# Altium schematic sheet FC_Conn.SchDoc
size A3; SheetNumber: 6; SheetTotal: 10
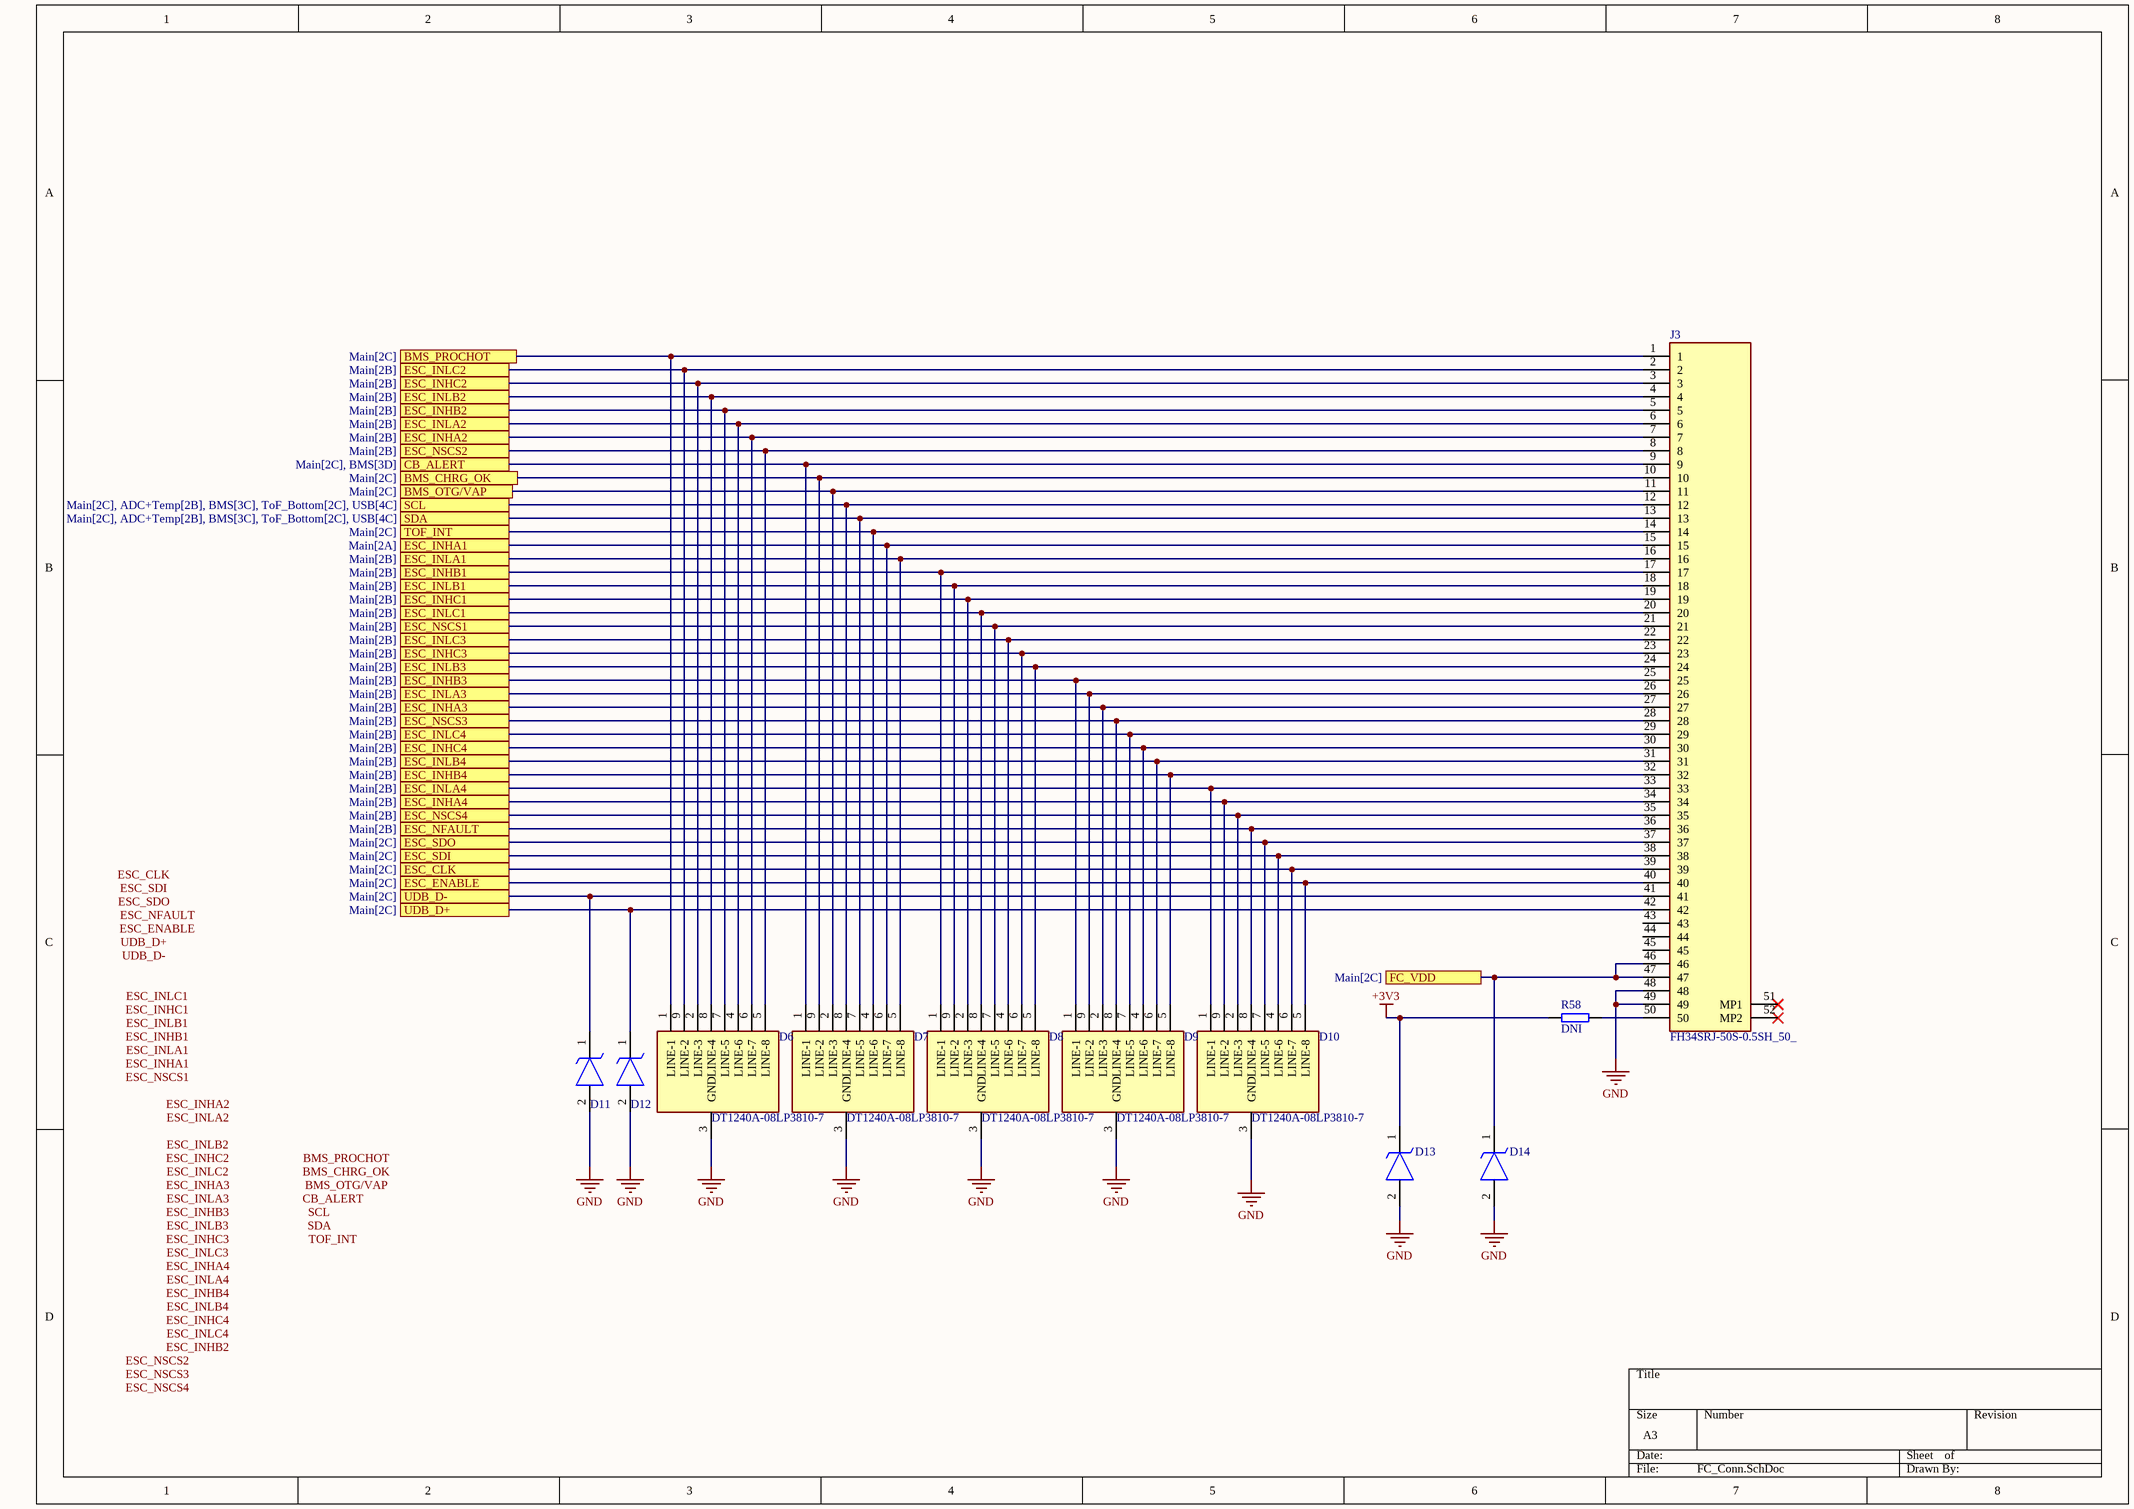
[diagram p0: FC_Conn.SchDoc]

## Parts
D6  DT1240A-08LP3810-7  [DT1240A08LP38107]
D7  DT1240A-08LP3810-7  [DT1240A08LP38107]
D8  DT1240A-08LP3810-7  [DT1240A08LP38107]
D9  DT1240A-08LP3810-7  [DT1240A08LP38107]
D10  DT1240A-08LP3810-7  [DT1240A08LP38107]
D11  D1213A-01LP4-7B  [D1213A01LP47B]  (value not drawn)
D12  D1213A-01LP4-7B  [D1213A01LP47B]  (value not drawn)
D13  DF2S24FS,L3M  [SODFL1006X45N]  (value not drawn)
D14  DF2S24FS,L3M  [SODFL1006X45N]  (value not drawn)
J3  FH34SRJ-50S-0.5SH_50_  [FH34SRJ50S05SH50]
R58  value DNI  [RES0402]  (hidden comment: Res0402)

## Ports
BMS_CHRG_OK (see Main[2C]), BMS_OTG/VAP (see Main[2C]), BMS_PROCHOT (see Main[2C]), CB_ALERT (see Main[2C], BMS[3D]), ESC_CLK (see Main[2C]), ESC_ENABLE (see Main[2C]), ESC_INHA1 (see Main[2A]), ESC_INHA2 (see Main[2B]), ESC_INHA3 (see Main[2B]), ESC_INHA4 (see Main[2B]), ESC_INHB1 (see Main[2B]), ESC_INHB2 (see Main[2B]), ESC_INHB3 (see Main[2B]), ESC_INHB4 (see Main[2B]), ESC_INHC1 (see Main[2B]), ESC_INHC2 (see Main[2B]), ESC_INHC3 (see Main[2B]), ESC_INHC4 (see Main[2B]), ESC_INLA1 (see Main[2B]), ESC_INLA2 (see Main[2B]), ESC_INLA3 (see Main[2B]), ESC_INLA4 (see Main[2B]), ESC_INLB1 (see Main[2B]), ESC_INLB2 (see Main[2B]), ESC_INLB3 (see Main[2B]), ESC_INLB4 (see Main[2B]), ESC_INLC1 (see Main[2B]), ESC_INLC2 (see Main[2B]), ESC_INLC3 (see Main[2B]), ESC_INLC4 (see Main[2B]), ESC_NFAULT (see Main[2B]), ESC_NSCS1 (see Main[2B]), ESC_NSCS2 (see Main[2B]), ESC_NSCS3 (see Main[2B]), ESC_NSCS4 (see Main[2B]), ESC_SDI (see Main[2C]), ESC_SDO (see Main[2C]), FC_VDD (see Main[2C]), SCL (see Main[2C], ADC+Temp[2B], BMS[3C], ToF_Bottom[2C], USB[4C]), SDA (see Main[2C], ADC+Temp[2B], BMS[3C], ToF_Bottom[2C], USB[4C]), TOF_INT (see Main[2C]), UDB_D+ (see Main[2C]), UDB_D- (see Main[2C])

## Nets
+3V3: D13.1(K) R58.2
GND: D6.3(GND) D7.3(GND) D8.3(GND) D9.3(GND) D10.3(GND) D11.2(A) D12.2(A) D13.2(A) D14.2(A) J3.48 J3.49
BMS_CHRG_OK: D7.9(LINE-2) J3.10 ; port BMS_CHRG_OK
BMS_OTG/VAP: D7.2(LINE-3) J3.11 ; port BMS_OTG/VAP
BMS_PROCHOT: D6.1(LINE-1) J3.1 ; port BMS_PROCHOT
CB_ALERT: D7.1(LINE-1) J3.9 ; port CB_ALERT
ESC_CLK: D10.6(LINE-7) J3.39 ; port ESC_CLK
ESC_ENABLE: D10.5(LINE-8) J3.40 ; port ESC_ENABLE
ESC_INHA1: D7.6(LINE-7) J3.15 ; port ESC_INHA1
ESC_INHA2: D6.6(LINE-7) J3.7 ; port ESC_INHA2
ESC_INHA3: D9.2(LINE-3) J3.27 ; port ESC_INHA3
ESC_INHA4: D10.9(LINE-2) J3.34 ; port ESC_INHA4
ESC_INHB1: D8.1(LINE-1) J3.17 ; port ESC_INHB1
ESC_INHB2: D6.7(LINE-5) J3.5 ; port ESC_INHB2
ESC_INHB3: D9.1(LINE-1) J3.25 ; port ESC_INHB3
ESC_INHB4: D9.5(LINE-8) J3.32 ; port ESC_INHB4
ESC_INHC1: D8.2(LINE-3) J3.19 ; port ESC_INHC1
ESC_INHC2: D6.2(LINE-3) J3.3 ; port ESC_INHC2
ESC_INHC3: D8.6(LINE-7) J3.23 ; port ESC_INHC3
ESC_INHC4: D9.4(LINE-6) J3.30 ; port ESC_INHC4
ESC_INLA1: D7.5(LINE-8) J3.16 ; port ESC_INLA1
ESC_INLA2: D6.4(LINE-6) J3.6 ; port ESC_INLA2
ESC_INLA3: D9.9(LINE-2) J3.26 ; port ESC_INLA3
ESC_INLA4: D10.1(LINE-1) J3.33 ; port ESC_INLA4
ESC_INLB1: D8.9(LINE-2) J3.18 ; port ESC_INLB1
ESC_INLB2: D6.8(LINE-4) J3.4 ; port ESC_INLB2
ESC_INLB3: D8.5(LINE-8) J3.24 ; port ESC_INLB3
ESC_INLB4: D9.6(LINE-7) J3.31 ; port ESC_INLB4
ESC_INLC1: D8.8(LINE-4) J3.20 ; port ESC_INLC1
ESC_INLC2: D6.9(LINE-2) J3.2 ; port ESC_INLC2
ESC_INLC3: D8.4(LINE-6) J3.22 ; port ESC_INLC3
ESC_INLC4: D9.7(LINE-5) J3.29 ; port ESC_INLC4
ESC_NFAULT: D10.8(LINE-4) J3.36 ; port ESC_NFAULT
ESC_NSCS1: D8.7(LINE-5) J3.21 ; port ESC_NSCS1
ESC_NSCS2: D6.5(LINE-8) J3.8 ; port ESC_NSCS2
ESC_NSCS3: D9.8(LINE-4) J3.28 ; port ESC_NSCS3
ESC_NSCS4: D10.2(LINE-3) J3.35 ; port ESC_NSCS4
ESC_SDI: D10.4(LINE-6) J3.38 ; port ESC_SDI
ESC_SDO: D10.7(LINE-5) J3.37 ; port ESC_SDO
FC_VDD: D14.1(K) J3.46 J3.47 ; port FC_VDD
SCL: D7.8(LINE-4) J3.12 ; port SCL
SDA: D7.7(LINE-5) J3.13 ; port SDA
TOF_INT: D7.4(LINE-6) J3.14 ; port TOF_INT
UDB_D+: D12.1(K) J3.42 ; port UDB_D+
UDB_D-: D11.1(K) J3.41 ; port UDB_D-
NetJ3_50: J3.50 R58.1

Not connected (* = marked no-connect by the designer): J3 43 44 45 51(MP1)* 52(MP2)*

## Notes on the sheet
- Each ESC can output 30mA, PB schould be able to sustain itself
- Labels drawn without touching a wire or pin: BMS_CHRG_OK, BMS_OTG/VAP, BMS_PROCHOT, CB_ALERT, ESC_CLK, ESC_ENABLE, ESC_INHA1, ESC_INHA2, ESC_INHA3, ESC_INHA4, ESC_INHB1, ESC_INHB2, ESC_INHB3, ESC_INHB4, ESC_INHC1, ESC_INHC2, ESC_INHC3, ESC_INHC4, ESC_INLA1, ESC_INLA2, ESC_INLA3, ESC_INLA4, ESC_INLB1, ESC_INLB2, ESC_INLB3, ESC_INLB4, ESC_INLC1, ESC_INLC2, ESC_INLC3, ESC_INLC4, ESC_NFAULT, ESC_NSCS1, ESC_NSCS2, ESC_NSCS3, ESC_NSCS4, ESC_SDI, ESC_SDO, SCL, SDA, TOF_INT, UDB_D+, UDB_D-

## Library data of the parts
D6-D10 = DT1240A-08LP3810-7: TVS Diode (Uni-directional); Manufacturer_Name: Diodes Incorporated; Datasheet Link: https://www.diodes.com//assets/Datasheets/DT1240A-08LP3810.pdf; Height: 0.55mm; Manufacturer_Part_Number: DT1240A-08LP3810-7; Mouser Part Number: 621-DT1240A08LP38107; Mouser Price/Stock: https://www.mouser.co.uk/ProductDetail/Diodes-Incorporated/DT1240A-08LP3810-7?qs=W0yvOO0ixfFwCalJyqXN4A%3D%3D; Arrow Part Number: DT1240A-08LP3810-7; Arrow Price/Stock: null?region=nac
D11 D12 = D1213A-01LP4-7B: TVS Diode (Uni-directional); Manufacturer_Name: Diodes Incorporated; Datasheet Link: https://www.diodes.com/assets/Datasheets/D1213A-01LP4.pdf; Height: 0.4mm; Manufacturer_Part_Number: D1213A-01LP4-7B; Mouser Part Number: 621-D1213A-01LP4-7B; Mouser Price/Stock: https://www.mouser.co.uk/ProductDetail/Diodes-Incorporated/D1213A-01LP4-7B?qs=gfe7vQ8txpVKfG5NOSOvfA%3D%3D; Arrow Part Number: D1213A-01LP4-7B; Arrow Price/Stock: https://www.arrow.com/en/products/d1213a-01lp4-7b/diodes-incorporated?region=europe
D13 D14 = DF2S24FS,L3M: TVS Diode (Uni-directional); Manufacturer_Name: Toshiba; Datasheet Link: https://www.mouser.com/datasheet/2/408/DF2S24FS_datasheet_en_20140718-708374.pdf; Height: 0.45mm; Manufacturer_Part_Number: DF2S24FS,L3M; Mouser Part Number: 757-DF2S24FSL3M; Mouser Price/Stock: https://www.mouser.co.uk/ProductDetail/Toshiba/DF2S24FSL3M?qs=lhkzy8lC%252BSvG2umxl0FuEw%3D%3D; Arrow Part Number: DF2S24FS,L3M; Arrow Price/Stock: https://www.arrow.com/en/products/df2s24fsl3m/toshiba?region=nac
J3 = FH34SRJ-50S-0.5SH_50_: Connector; Manufacturer_Name: Hirose; Manufacturer_Part_Number: FH34SRJ-50S-0.5SH(50); Datasheet Link: https://www.hirose.com/en/product/document?clcode=CL0580-1266-2-50&productname=FH34SRJ-50S-0.5SH(50)&series=FH34SRJ&documenttype=2DDrawing&lang=en&documentid=0001483059; Height: 1.75mm; Mouser Part Number: 798-FH34SRJ50S05SH50; Mouser Price/Stock: https://www.mouser.co.uk/ProductDetail/Hirose-Connector/FH34SRJ-50S-0.5SH50?qs=vcbW%252B4%252BSTIrLLD%2F8H%2F%252B%2Fhg%3D%3D; System: Connector